# EAGLE design 2te8x24V_DC_In (EAGLE 5.04)
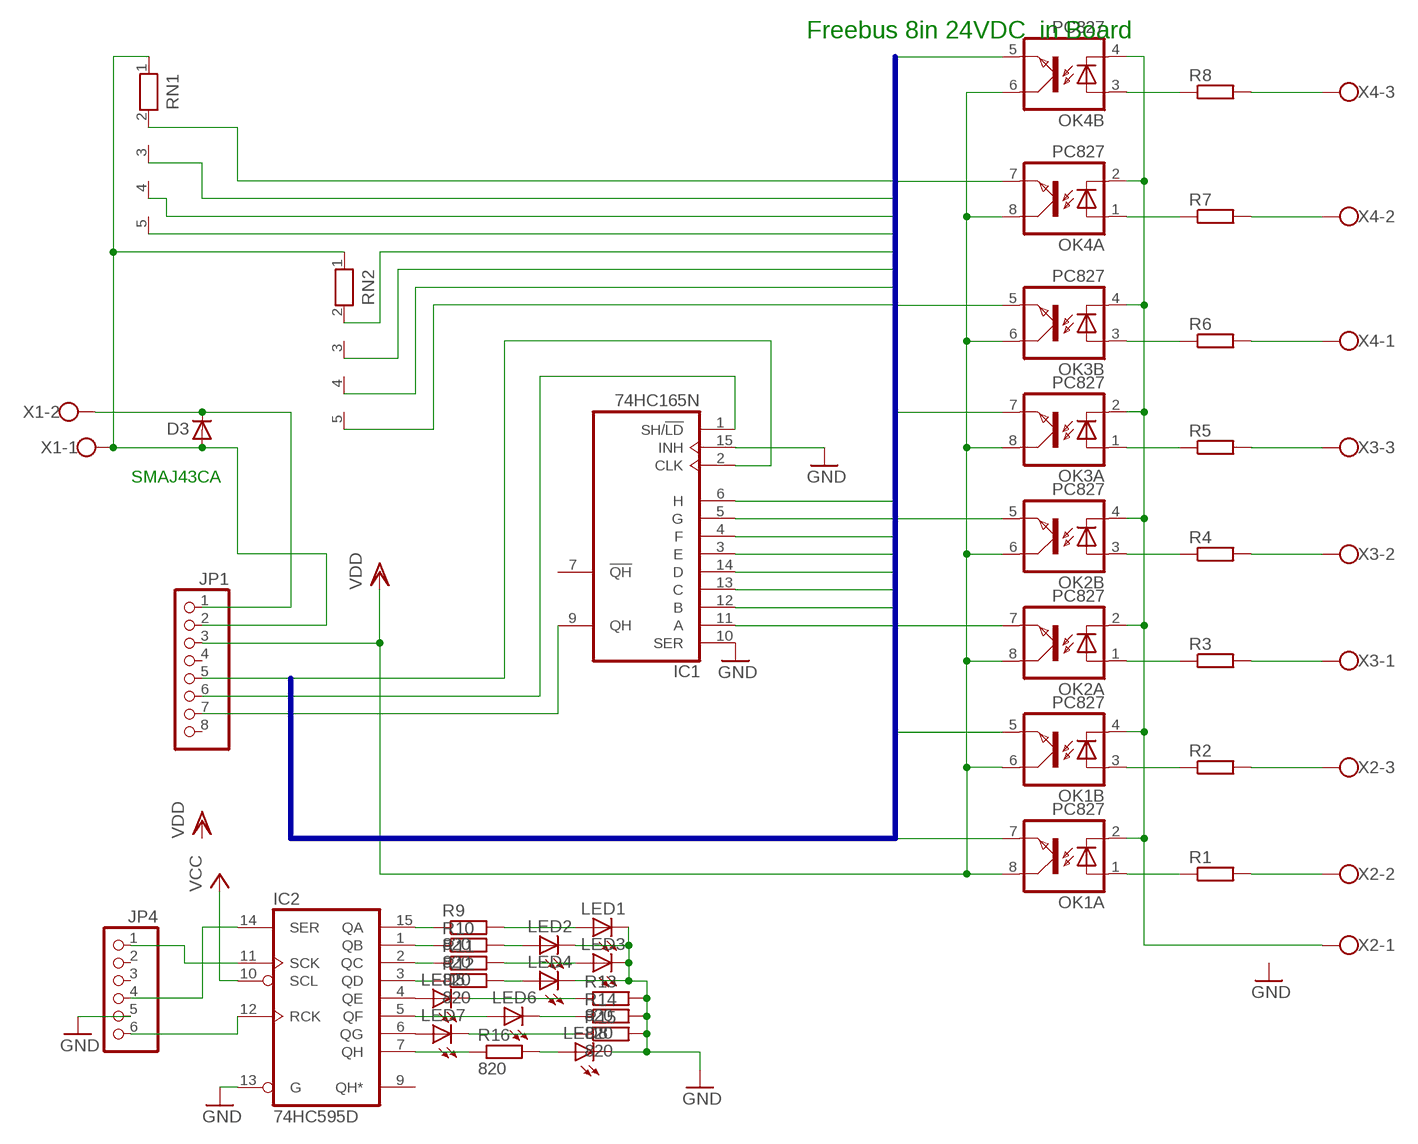
[diagram p0: schematic, sheet 1]

## Parts
D3  D-SMB  [SMB]
IC1  74HC165N  [DIL16]
IC2  74HC595D  [SO16]
JP1  PINHD-1X8  [1X08]
JP4  PINHD-1X6  [1X06]
LED1  LED3MM  [LED3MM]
LED2  LED3MM  [LED3MM]
LED3  LED3MM  [LED3MM]
LED4  LED3MM  [LED3MM]
LED5  LED3MM  [LED3MM]
LED6  LED3MM  [LED3MM]
LED7  LED3MM  [LED3MM]
LED8  LED3MM  [LED3MM]
OK1  PC827  [DIL08]
OK2  PC827  [DIL08]
OK3  PC827  [DIL08]
OK4  PC827  [DIL08]
R1  R-EU_0207/2V  [0207/2V]
R2  R-EU_0207/2V  [0207/2V]
R3  R-EU_0207/2V  [0207/2V]
R4  R-EU_0207/2V  [0207/2V]
R5  R-EU_0207/2V  [0207/2V]
R6  R-EU_0207/2V  [0207/2V]
R7  R-EU_0207/2V  [0207/2V]
R8  R-EU_0207/2V  [0207/2V]
R9  820  R-EU_0204/7  [0204/7]
R10  820  R-EU_0204/7  [0204/7]
R11  820  R-EU_0204/7  [0204/7]
R12  820  R-EU_0204/7  [0204/7]
R13  820  R-EU_0204/7  [0204/7]
R14  820  R-EU_0204/7  [0204/7]
R15  820  R-EU_0204/7  [0204/7]
R16  820  R-EU_0204/7  [0204/7]
RN1  RN04  [RN-5]
RN2  RN04  [RN-5]
X1  W237-02P  [W237-132]
X2  W237-03P  [W237-133]
X3  W237-3E  [W237-3E]
X4  W237-3E  [W237-3E]

## Nets
EIB+: D3.1(C) JP1.1 X1.2
GND: D3.2(A) IC1.10(SER) IC1.15(INH) IC2.13(G) JP1.2 JP4.5 LED1.K(C) LED2.K(C) LED3.K(C) LED4.K(C) LED8.K(C) R13.2 R14.2 R15.2 RN1.1 RN2.1 X1.1
GND24: OK1.2(A:C) OK1.4(B:C) OK2.2(A:C) OK2.4(B:C) OK3.2(A:C) OK3.4(B:C) OK4.2(A:C) OK4.4(B:C) X2.1
IO1: IC1.11(A) OK1.7(A:EMIT) RN2.2
IO2: IC1.12(B) OK1.5(B:EMIT) RN2.3
IO3: IC1.13(C) OK2.7(A:EMIT) RN2.4
IO4: IC1.14(D) OK2.5(B:EMIT) RN2.5
IO5: IC1.3(E) OK3.7(A:EMIT) RN1.5
IO6: IC1.4(F) OK3.5(B:EMIT) RN1.4
IO7: IC1.5(G) OK4.7(A:EMIT) RN1.3
IO8: IC1.6(H) OK4.5(B:EMIT) RN1.2
N$1: IC1.9(QH) JP1.7
N$2: OK1.1(A:A) R1.1
N$3: R1.2 X2.2
N$4: OK1.3(B:A) R2.1
N$5: R2.2 X2.3
N$6: OK2.1(A:A) R3.1
N$7: R3.2 X3.1
N$8: OK2.3(B:A) R4.1
N$9: R4.2 X3.2
N$10: OK3.1(A:A) R5.1
N$11: R5.2 X3.3
N$12: OK3.3(B:A) R6.1
N$13: R6.2 X4.1
N$14: OK4.1(A:A) R7.1
N$15: R7.2 X4.2
N$16: OK4.3(B:A) R8.1
N$17: R8.2 X4.3
N$18: IC1.1(SH/!LD) JP1.6
N$19: IC1.2(CLK) JP1.5
N$20: IC2.15(QA) R9.1
N$21: IC2.1(QB) R10.1
N$22: IC2.2(QC) R11.1
N$23: IC2.3(QD) R12.1
N$24: IC2.4(QE) LED5.A
N$25: IC2.5(QF) LED6.A
N$26: IC2.6(QG) LED7.A
N$28: IC2.12(RCK) JP4.6
N$29: LED1.A R9.2
N$30: LED2.A R10.2
N$31: LED3.A R11.2
N$32: LED4.A R12.2
N$33: LED5.K(C) R13.1
N$34: LED6.K(C) R14.1
N$35: LED7.K(C) R15.1
N$36: IC2.7(QH) R16.1
N$37: LED8.A R16.2
N$38: IC2.11(SCK) JP4.1
N$39: IC2.14(SER) JP4.4
VCC: IC2.10(SCL)
VDD: JP1.3 OK1.6(B:COL) OK1.8(A:COL) OK2.6(B:COL) OK2.8(A:COL) OK3.6(B:COL) OK3.8(A:COL) OK4.6(B:COL) OK4.8(A:COL)
Unconnected: IC1.7(!QH) IC2.9(QH*) JP1.4 JP1.8 JP4.2 JP4.3

## Buses
IO[1..8]

## Notes on the sheet
- Freebus 8in 24VDC  in Board
- SMAJ43CA

## Power pins joined to a net without a drawn wire
GND: IC1.8(GND) IC2.8(GND)
VCC: IC1.16(VCC) IC2.16(VCC)

## Library data of the parts
D3 = semicon-smd-ipc:D-: DIODE unfilled
IC1 = 74xx-eu:74*165: 8-bit parallel load SHIFT REGISTER
IC2 = 74xx-eu:74*595: 8-bit SHIFT REGISTER, output latch
JP1 = pinhead:PINHD-1X8: PIN HEADER
JP4 = pinhead:PINHD-1X6: PIN HEADER
LED1-LED8 = led:LED: LED OSRAM: - CHIPLED LG R971, LG N971, LY N971, LG Q971, LY Q971, LO R971, LY R971 LH N974, LH R974 LS Q976, LO Q976, LY Q976 LO Q996 - Hyper CHIPLED LW Q18S LB Q993, LB Q99A, LB R99A - SideLED LS A670, LO A670, LY A670, LG A670, LP A670 LB A673, LV A673, LT A673, LW A673 LH A674 LY A675 LS A676, LA A676, LO A676, LY A676, LW A676 LS A679, LY A679, LG A679 - Hyper Micro SIDELED® LS Y876, LA Y876, LO Y876, LY Y876 LT Y87S - SmartLED LW L88C, LW L88S LB L89C, LB L89S, LG L890 LS L89K, LO L89K, LY L89K LS L896, LA L896, LO L896, LY L896 - TOPLED LS T670, LO T670, LY T670, LG T670, LP T670 LSG T670, LSP T670, LSY T670, LOP T670, LYG T670 LG T671, LOG T671, LSG T671 LB T673, LV T673, LT T673, LW T673 LH T674 LS T676, LA T676, LO T676, LY T676, LB T676, LH T676, LSB T676, LW T676 LB T67C, LV T67C, LT T67C, LS T67K, LO T67K, LY T67K, LW E67C LS E67B, LA E67B, LO E67B, LY E67B, LB E67C, LV E67C, LT E67C LW T67C LS T679, LY T679, LG T679 LS T770, LO T770, LY T770, LG T770, LP T770 LB T773, LV T773, LT T773, LW T773 LH T774 LS E675, LA E675, LY E675, LS T675 LS T776, LA T776, LO T776, LY T776, LB T776 LHGB T686 LT T68C, LB T68C - Hyper Mini TOPLED® LB M676 - Mini TOPLED Santana® LG M470 LS M47K, LO M47K, LY M47K Source: http://www.osram.convergy.de - LUMILED® LXK2-PW12-R00, LXK2-PW12-S00, LXK2-PW14-U00, LXK2-PW14-V00 LXK2-PM12-R00, LXK2-PM12-S00, LXK2-PM14-U00 LXK2-PE12-Q00, LXK2-PE12-R00, LXK2-PE12-S00, LXK2-PE14-T00, LXK2-PE14-U00 LXK2-PB12-K00, LXK2-PB12-L00, LXK2-PB12-M00, LXK2-PB14-N00, LXK2-PB14-P00, LXK2-PB14-Q00 LXK2-PR12-L00, LXK2-PR12-M00, LXK2-PR14-Q00, LXK2-PR14-R00 LXK2-PD12-Q00, LXK2-PD12-R00, LXK2-PD12-S00 LXK2-PH12-R00, LXK2-PH12-S00 LXK2-PL12-P00, LXK2-PL12-Q00, LXK2-PL12-R00 Source: www.luxeon.com
OK1-OK4 = optocoupler:PC827: SHARP OPTO COUPLER
R1-R16 = rcl:R-EU_: RESISTOR, European symbol
RN1 RN2 = resistor-net:RN04: RESISTOR NETWORK
X1 = con-wago-508:W237-02P: WAGO SREW CLAMP
X2 = con-wago-508:W237-03P: WAGO SREW CLAMP
X3 X4 = con-wago-508:W237-3E: WAGO SREW CLAMP

## Board
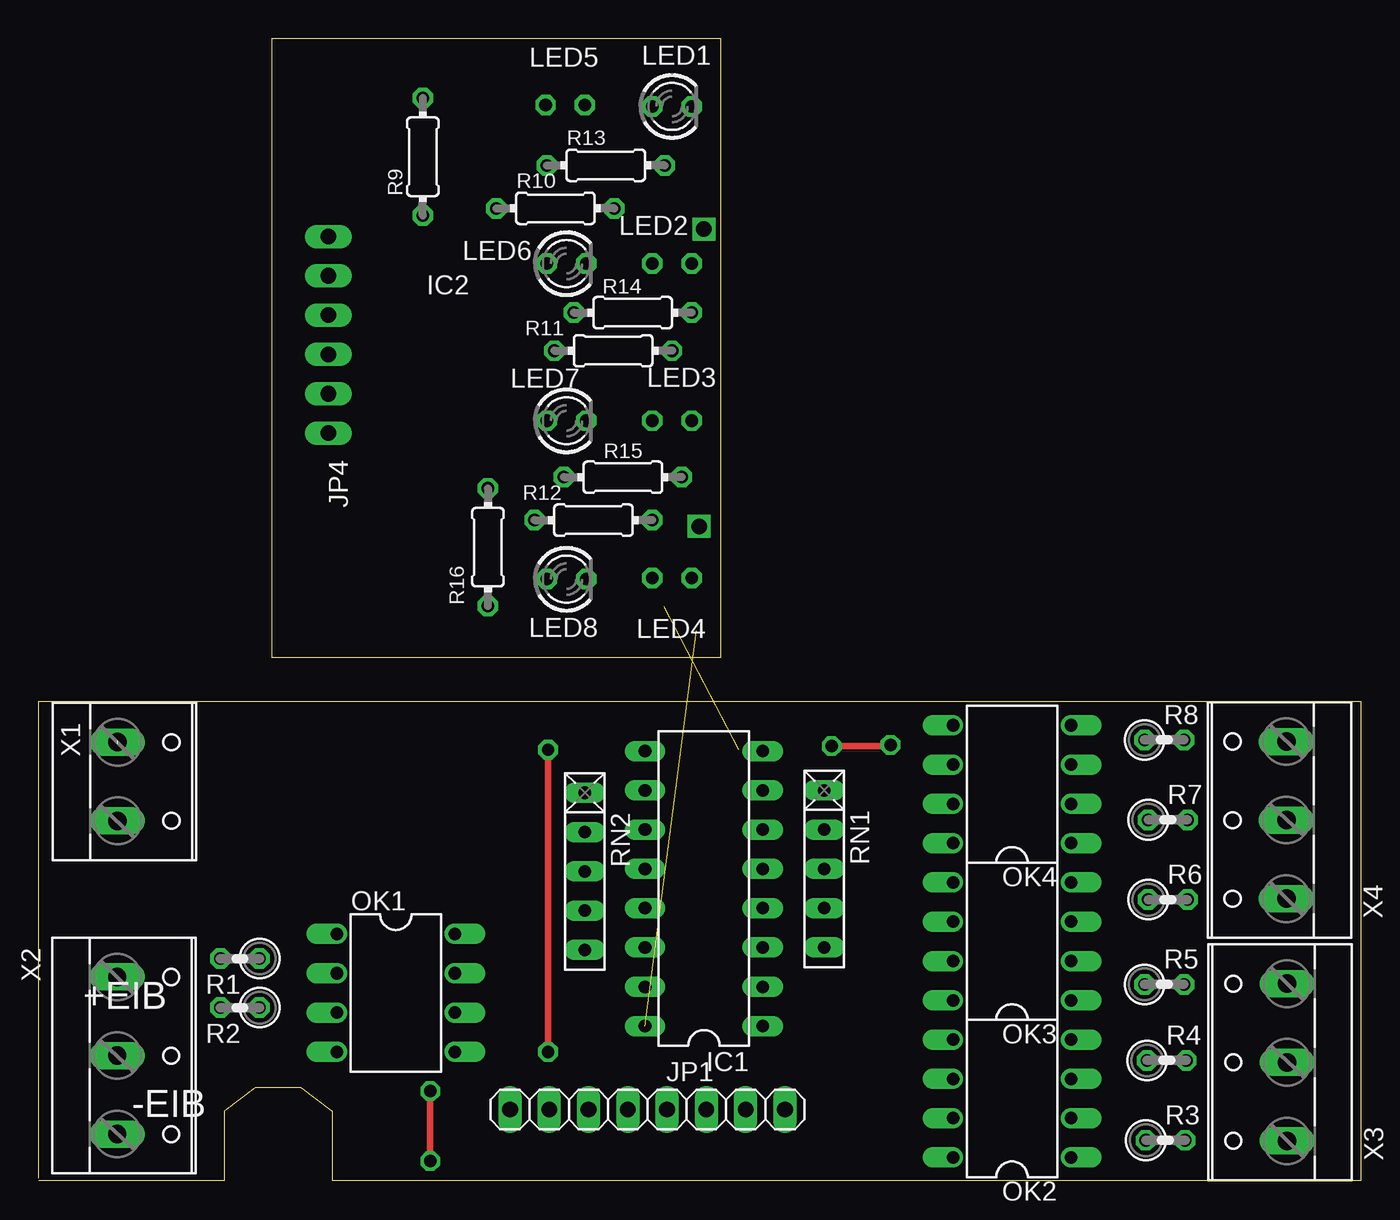
[diagram p1: board, top side]
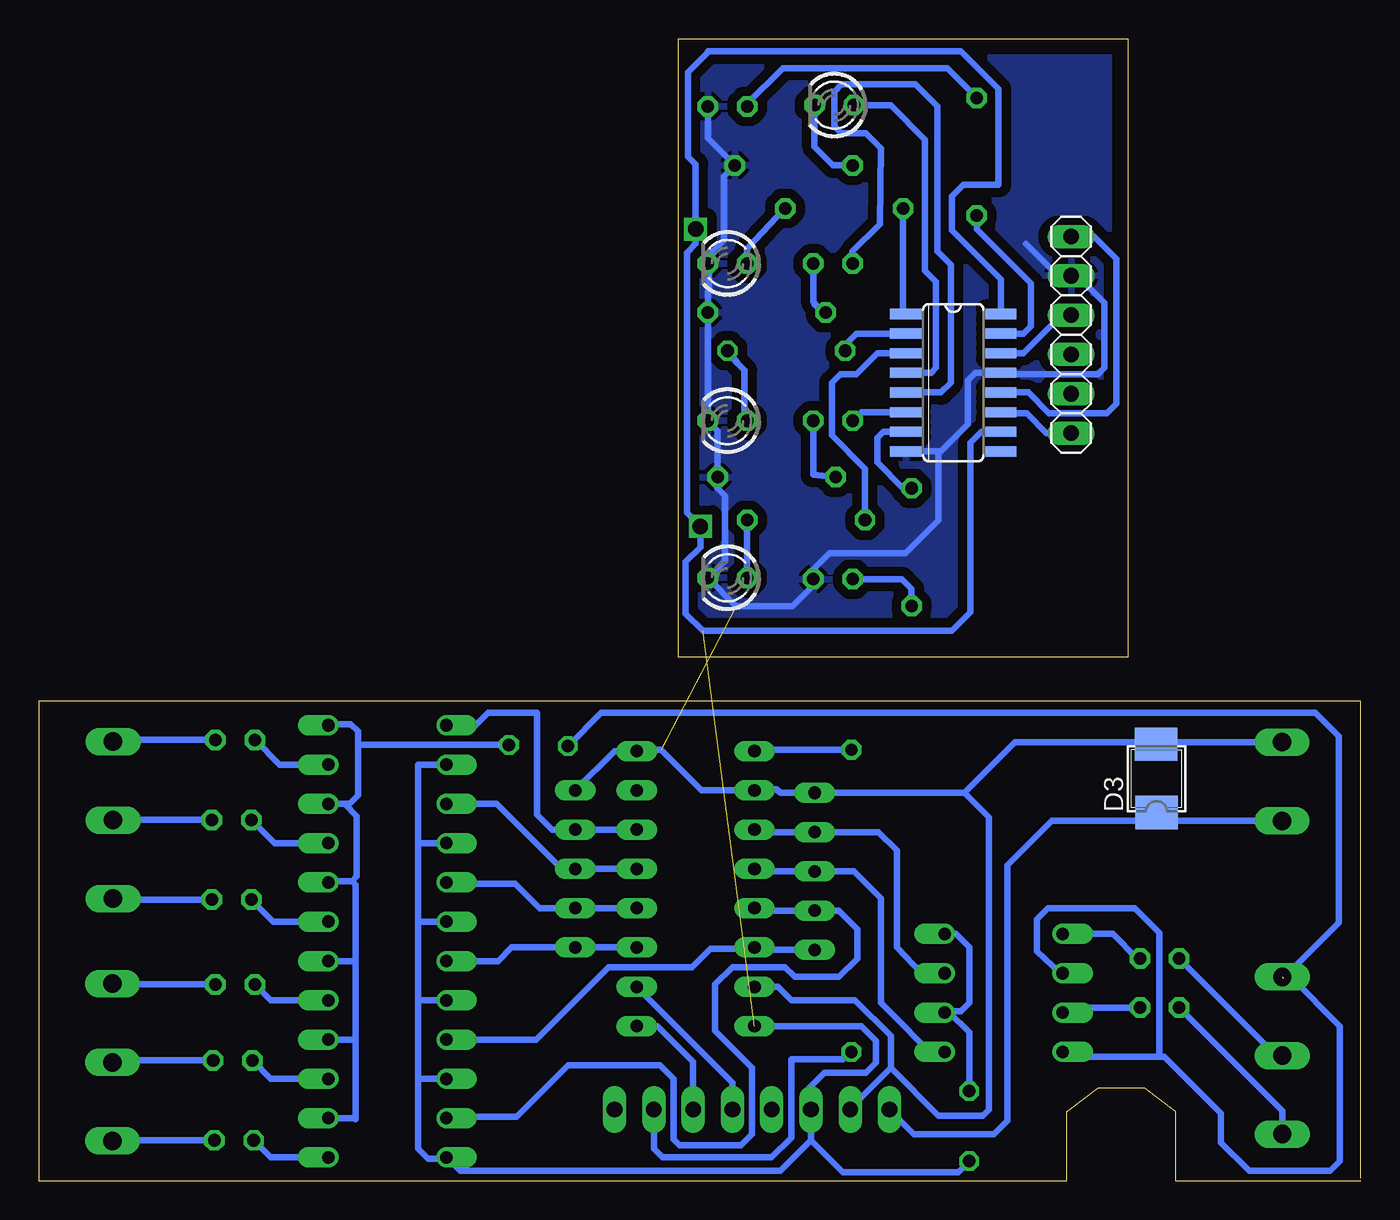
[diagram p2: board, bottom side, seen from below]

Size 85.5 x 73.83 mm. Coordinates in mm from the lower left corner, seen from the top.
Outline: 0.01,0.16 0.01,31 85.5,31 85.5,0 19,0 19,4.5 18.99,4.51 16.99,6.01 14.01,6.01 14.01,6 12,4.49 12,0 0,0
Outline: 44.12,73.83 15.08,73.83
Outline: 15.08,73.83 15.08,33.83
Outline: 15.08,33.83 44.12,33.83
Outline: 44.12,33.83 44.12,73.83
Copper layers (1*16): Top 0.035mm / dielectric 1.5mm / Bottom 0.035mm
Design rules "default": minimum track width 10mil, minimum drill 24mil, track to track 8mil, track to pad 8mil, pad to pad 8mil, via to via 8mil, smd to smd 8mil, copper to edge 40mil, drill to drill 8mil, minimum pad ring 10mil, minimum via ring 8mil, stop-mask expansion 4mil, vias tented up to drill 0mil, thermal gap 10mil

### Footprints (pad centres in the part's own frame; a part is rotated, then mirrored left to right if it is on the bottom)
SMB = smd 2.159 x 2.743: 1 -2.311,-0.127; 2 2.108,-0.102
DIL16 = drill 0.813 long: 1 -8.89,-3.81; 2 -6.35,-3.81; 3 -3.81,-3.81; 4 -1.27,-3.81; 5 1.27,-3.81; 6 3.81,-3.81; 7 6.35,-3.81; 8 8.89,-3.81; 9 8.89,3.81; 10 6.35,3.81; 11 3.81,3.81; 12 1.27,3.81; 13 -1.27,3.81; 14 -3.81,3.81; 15 -6.35,3.81; 16 -8.89,3.81
SO16 = smd 0.66 x 2.032: 1 -4.445,-3.073; 2 -3.175,-3.073; 3 -1.905,-3.073; 4 -0.635,-3.073; 5 0.635,-3.073; 6 1.905,-3.073; 7 3.175,-3.073; 8 4.445,-3.073; 9 4.445,3.073; 10 3.175,3.073; 11 1.905,3.073; 12 0.635,3.073; 13 -0.635,3.073; 14 -1.905,3.073; 15 -3.175,3.073; 16 -4.445,3.073
1X08 = drill 1.016 long: 1 -8.89,0; 2 -6.35,0; 3 -3.81,0; 4 -1.27,0; 5 1.27,0; 6 3.81,0; 7 6.35,0; 8 8.89,0
1X06 = drill 1.016 long: 1 -6.35,0; 2 -3.81,0; 3 -1.27,0; 4 1.27,0; 5 3.81,0; 6 6.35,0
LED3MM = drill 0.813 octagon: A -1.27,0; K 1.27,0
DIL08 = drill 0.813 offset: 1 -3.81,-3.81; 2 -1.27,-3.81; 3 1.27,-3.81; 4 3.81,-3.81; 5 3.81,3.81; 6 1.27,3.81; 7 -1.27,3.81; 8 -3.81,3.81
0207/2V = drill 0.813 octagon: 1 -1.27,0; 2 1.27,0
0204/7 = drill 0.813 octagon: 1 -3.81,0; 2 3.81,0
RN-5 = drill 0.813 long: 1 -5.08,0; 2 -2.54,0; 3 0,0; 4 2.54,0; 5 5.08,0
W237-132 = drill 1.194 long: 1 -2.54,-0.635; 2 2.54,-0.635
W237-133 = drill 1.194 long: 1 -5.08,-0.635; 2 0,-0.635; 3 5.08,-0.635
W237-3E = drill 1.194 long: 1 -5.08,-0.635; 2 0,-0.635; 3 5.08,-0.635

### Placement (x,y rotation side)
D3  13.33,26.12 90 bottom
IC1  43.02,18.89 90 top
IC2  26.35,51.6 270 bottom
JP1  39.37,4.61 0 top
JP4  18.73,54.69 90 bottom
LED1  40.96,69.46 0 top
LED2  40.96,59.29 180 bottom
LED3  40.96,49.14 180 bottom
LED4  40.96,38.98 180 bottom
LED5  34.05,69.53 180 bottom
LED6  34.13,59.3 0 top
LED7  34.13,49.14 0 top
LED8  34.13,38.9 0 top
OK1  23.1,12.15 270 top
OK2  62.94,5.32 90 top
OK3  62.94,15.48 90 top
OK4  62.94,25.64 90 top
R1  13.02,14.37 180 top
R2  13.02,11.19 180 top
R3  72.87,2.62 0 top
R4  72.94,7.78 0 top
R5  72.79,12.7 0 top
R6  73.02,18.18 0 top
R7  73.02,23.34 0 top
R8  72.79,28.5 0 top
R9  24.84,66.2 90 top
R10  33.42,62.87 0 top
R11  37.15,53.66 0 top
R12  35.88,42.71 0 top
R13  36.67,65.65 0 top
R14  38.42,56.12 0 top
R15  37.78,45.48 0 top
R16  29.05,40.96 270 top
RN1  50.8,20.16 270 top
RN2  35.32,20 270 top
X1  5.74,25.81 270 top
X2  5.71,8.1 270 top
X3  80.1,7.66 90 top
X4  80.05,23.32 90 top

### Tracks (layer width: path | path; a pad name or v marks a point on that pad's centre or on a via)
EIB+
  Bottom 0.406: 12.68,23.27 X1.2 | 12.68,23.27 D3.1 13.22,23.81 | 12.68,23.27 19.99,23.27 22.86,20.4 22.86,3.89 23.73,3.02 28.89,3.02 30.08,4.21 JP1.1
GND  (1 unrouted)
  Bottom 0.406: X1.1 13.1,28.35 D3.2 13.35,28.34 22.38,28.34 25.64,25.08 | 25.64,25.08 RN2.1 37.54,25.08 37.78,25.32 39.13,25.32 IC1.10 42.62,25.24 45.24,27.86 46.75,27.86 IC1.8 48.26,27.78 RN1.1 | 33.02,3.34 JP1.2 33.02,4.68 30.4,7.3 | 25.64,25.08 24.05,23.5 24.05,4.61 24.45,4.21 27.3,4.21 30.4,7.3 | 30.4,7.3 30.4,9.37 32.7,11.67 36.83,11.67 37.7,12.54 IC1.15 | 29.58,46.99 IC2.8 27.14,47.15 | 27.14,47.15 25.4,48.9 25.4,51.76 24.92,52.23 IC2.13 23.2,52.15 16.98,52.15 16.59,52.55 16.59,56.76 18.33,58.5 JP4.5 19.61,58.5 21.67,60.57 | LED1.K 42.23,67.39 R13.2 41.2,64.93 41.2,60.8 42.23,59.77 LED2.K 42.15,59.22 42.15,57.55 42.23,57.47 R14.2 LED3.K 41.59,48.5 R15.2 41.59,44.77 41.12,44.29 41.12,40.09 LED4.K 40.4,37.15 36.75,37.15 35.4,38.5 35.4,39.53 | 35.4,39.53 LED8.K | 35.4,39.53 34.37,40.56 29.45,40.56 27.3,42.71 27.3,46.99 27.14,47.15
  pour Bottom (isolate 0.61): 14.84,74.14 14.84,33.5 44.61,33.5 44.61,74.14 15.64,74.14
GND24  (via drill 0.8 pad 1.27)  (1 unrouted)
  Top 0.406: v51.28,28.1 55.01,28.1 v55.09,28.18
  Bottom 0.406: 65.24,19.37 64.93,19.69 64.93,23.58 65.72,24.37 OK4.2 65.4,24.37 64.85,24.93 64.85,28.26 | 65.24,19.37 66.67,19.37 OK3.4 | OK2.2 65.09,4.05 65.01,3.97 65.01,9.21 | 65.01,14.37 65.01,9.21 | 65.01,14.37 65.01,19.13 65.24,19.37 | 64.85,28.26 64.85,29.05 65.32,29.53 66.67,29.53 OK4.4 | OK3.2 65.17,14.21 65.01,14.37 | OK2.4 65.09,9.13 65.01,9.21 | X2.1 4.52,13.18 1.35,10 1.35,1.27 1.98,0.64 7.22,0.64 9.05,2.46 9.05,4.37 12.7,8.02 13.02,8.02 | 13.02,8.02 18.97,8.02 OK1.4 | OK1.2 19.45,13.42 20.95,14.85 20.95,16.91 20.24,17.62 14.6,17.62 13.02,16.04 13.02,8.02 | 5,13.1 1.43,16.67 1.43,28.74 2.94,30.24 49.13,30.24 v51.28,28.1 | v55.09,28.18 64.77,28.18 64.85,28.26
IO1
  Bottom 0.406: RN2.2 39.21,22.54 IC1.11 | OK1.7 28.41,13.42 30,15.08 30,21.35 31.19,22.54 RN2.2 | RN2.2
IO2
  Bottom 0.406: RN2.3 39.21,20 IC1.12 | OK1.5 28.34,8.34 28.34,8.81 29.92,10.4 31.04,11.51 31.04,18.26 32.78,20 RN2.3 | RN2.3
IO3
  Bottom 0.406: 40.08,17.62 IC1.13 39.21,17.46 RN2.4 33.73,17.46 32.54,16.27 32.54,14.37 33.73,13.18 36.59,13.18 37.23,13.81 40.64,13.81 41.75,12.7 41.75,9.69 39.37,7.3 39.37,3.02 40.08,2.3 44.05,2.3 44.45,2.7 44.45,6.59 45.32,7.46 51.28,7.46 54.61,4.13 59.05,4.13 OK2.7
IO4
  Bottom 0.406: RN2.5 39.05,14.93 IC1.14 39.29,15 42.07,15 43.26,13.81 48.66,13.81 53.34,9.13 OK2.5
IO5
  Bottom 0.406: 59.05,14.13 OK3.7 55.8,14.21 54.93,15.08 RN1.5 IC1.3
IO6
  Bottom 0.406: IC1.4 RN1.4 53.1,17.62 54.69,19.21 59.05,19.21 OK3.5
IO7
  Bottom 0.406: OK4.7 59.05,24.45 | IC1.5 RN1.3 51.67,20.16 55.88,24.37 OK4.7 | OK4.7
IO8
  Bottom 0.406: OK4.5 | IC1.6 RN1.2 52.31,22.7 53.26,23.66 53.26,26.91 53.26,30.24 56.44,30.24 57.31,29.37 59.05,29.37 OK4.5
N$1  (via drill 0.8 pad 1.27)
  Top 0.406: v32.94,8.34 v32.94,27.86
  Bottom 0.406: JP1.7 45.72,2.07 45.16,1.51 38.1,1.51 36.83,2.78 36.83,7.86 33.5,7.86 v32.94,8.34 | v32.94,27.86 39.13,27.86 IC1.9
N$2
  Bottom 0.406: R1.1 14.45,14.37 16.03,15.96 OK1.1 | OK1.1
N$3
  Bottom 0.406: X2.2 5.48,8.1 R1.2
N$4
  Bottom 0.406: R2.1 18.1,11.19 18.33,10.96 19.21,10.96 OK1.3
N$5
  Bottom 0.406: X2.3 5.08,4.53 R2.2
N$6
  Bottom 0.406: OK2.1 70.48,1.51 R3.1
N$7
  Bottom 0.406: R3.2 80.73,2.62 X3.1
N$8
  Bottom 0.406: OK2.3 70.48,6.59 R4.1
N$9
  Bottom 0.406: R4.2 80.73,7.78 X3.2
N$10
  Bottom 0.406: OK3.1 70.48,11.67 R5.1
N$11
  Bottom 0.406: R5.2 80.73,12.7 X3.3
N$12
  Bottom 0.406: OK3.3 70.32,16.75 R6.1
N$13
  Bottom 0.406: R6.2 80.68,18.18 X4.1
N$14
  Bottom 0.406: OK4.1 70.25,21.83 R7.1
N$15
  Bottom 0.406: R7.2 80.68,23.34 X4.2
N$16
  Bottom 0.406: OK4.3 69.93,26.91 R8.1
N$17
  Bottom 0.406: R8.2 80.68,28.5 X4.3
N$18
  Bottom 0.406: JP1.6 43.18,7.7 45.48,10 IC1.1
N$19
  Bottom 0.406: JP1.5 40.64,6.35 IC1.2
N$20
  Bottom 0.406: R9.1 24.84,61.52 21.35,58.03 21.35,55.25 21.83,54.77 IC2.15
N$21
  Bottom 0.406: R10.1 29.61,56.22 IC2.1
N$22
  Bottom 0.406: R11.1 33.34,54.06 32.62,54.77 IC2.2
N$23
  Bottom 0.406: R12.1 32.07,46.04 34.21,48.18 34.21,51.6 33.65,52.15 32.62,52.15 31.27,53.5 IC2.3
N$24
  Bottom 0.406: LED5.A 30.4,69.53 28.18,67.31 28.18,58.82 27.46,58.1 27.46,52.55 27.78,52.23 IC2.4
N$25
  Bottom 0.406: LED6.A 32.86,60.09 31.11,61.84 31.04,66.76 31.99,67.71 33.58,67.71 34.05,68.19 34.05,70.41 33.58,70.88 28.81,70.88 27.38,69.45 27.38,60.09 26.51,59.22 26.51,51.6 27.14,50.96 IC2.5
N$26
  Bottom 0.406: IC2.6 32.3,49.69 LED7.A
N$28
  Bottom 0.406: JP4.6 17.22,61.04 15.79,59.61 15.79,50.25 16.43,49.61 20.16,49.61 21.51,50.96 IC2.12
N$29
  Bottom 0.406: R9.2 26.75,71.92 37.39,71.92 39.69,69.61 LED1.A
N$30
  Bottom 0.406: R10.2 39.69,60.25 LED2.A
N$31
  Bottom 0.406: LED3.A 39.84,49.29 39.84,52.39 40.32,52.87 R11.2
N$32
  Bottom 0.406: LED4.A R12.2
N$33
  Bottom 0.406: LED5.K 35.32,66.84 34.13,65.64 32.7,65.64 R13.1
N$34
  Bottom 0.406: LED6.K 35.4,56.84 35.32,56.76 35.32,56.68 R14.1
N$35
  Bottom 0.406: LED7.K 35.4,45.64 R15.1
N$36
  Bottom 0.406: IC2.7 30.88,48.42 31.27,48.02 31.27,46.44 29.61,44.77 R16.1
N$37
  Bottom 0.406: R16.2 29.05,38.26 29.68,38.9 LED8.A
N$38
  Bottom 0.406: JP4.1 20.32,48.34 21.59,49.61 23.2,49.61 IC2.11
N$39
  Bottom 0.406: JP4.4 19.37,55.96 21.83,53.5 IC2.14
VCC  (via drill 1 pad 1.42)  (1 unrouted)
  Bottom 0.406: 35.72,4.53 35.72,5.96 34.69,6.99 31.99,6.99 31.35,7.62 31.35,9.05 32.3,10 IC1.16 | IC2.16 23.28,58.29 26.43,61.44 26.43,63.66 25.72,64.38 23.44,64.38 23.44,70.59 25.88,73.03 42.23,73.03 42.23,72.95 43.5,71.68 43.5,66.2 43.02,65.72 v43.02,61.52 43.02,60.57 43.58,60.01 43.58,43.18 v42.7,42.31 42.7,40.96 43.66,40.01 43.66,36.67 42.54,35.56 26.43,35.56 25.24,36.75 25.24,47.71 24.53,48.42 IC2.10
VDD  (via drill 0.8 pad 1.27)
  Top 0.406: v25.32,1.27 v25.32,5.8
  Bottom 0.406: 60.96,26.91 OK4.6 | 60.96,26.91 | 60.96,6.43 60.96,2.07 60.32,1.43 59.21,1.43 OK2.8 58.26,0.64 37.54,0.64 35.56,2.62 | 60.96,6.43 60.96,11.51 | 60.96,11.51 60.96,16.59 | 60.96,16.59 60.96,21.75 | 60.96,21.75 60.96,26.91 | OK4.8 60.88,21.83 60.96,21.75 | OK3.6 60.8,16.75 60.96,16.59 | OK3.8 60.8,11.67 60.96,11.51 | OK2.6 60.8,6.59 60.96,6.43 | 35.56,2.62 JP1.3 | OK1.8 26.19,15.96 25.32,15.08 25.32,11.51 25.88,10.96 26.83,10.96 OK1.6 26.59,10.88 25.32,9.61 v25.32,5.8 | v25.32,1.27 26.03,0.56 33.5,0.56 35.56,2.62

### Text on the board
tPlace: +EIB | -EIB